# Altium schematic sheet 02_ESP12_CORE.SchDoc: ESP-12 CORE
size A4; Date: 20/11/2014; Author: HuangRui <vowstar@gmail.com>; DrawnBy: JiYaping <jyp1817@gmail.com>; Organization: WWW.NODEMCU.COM
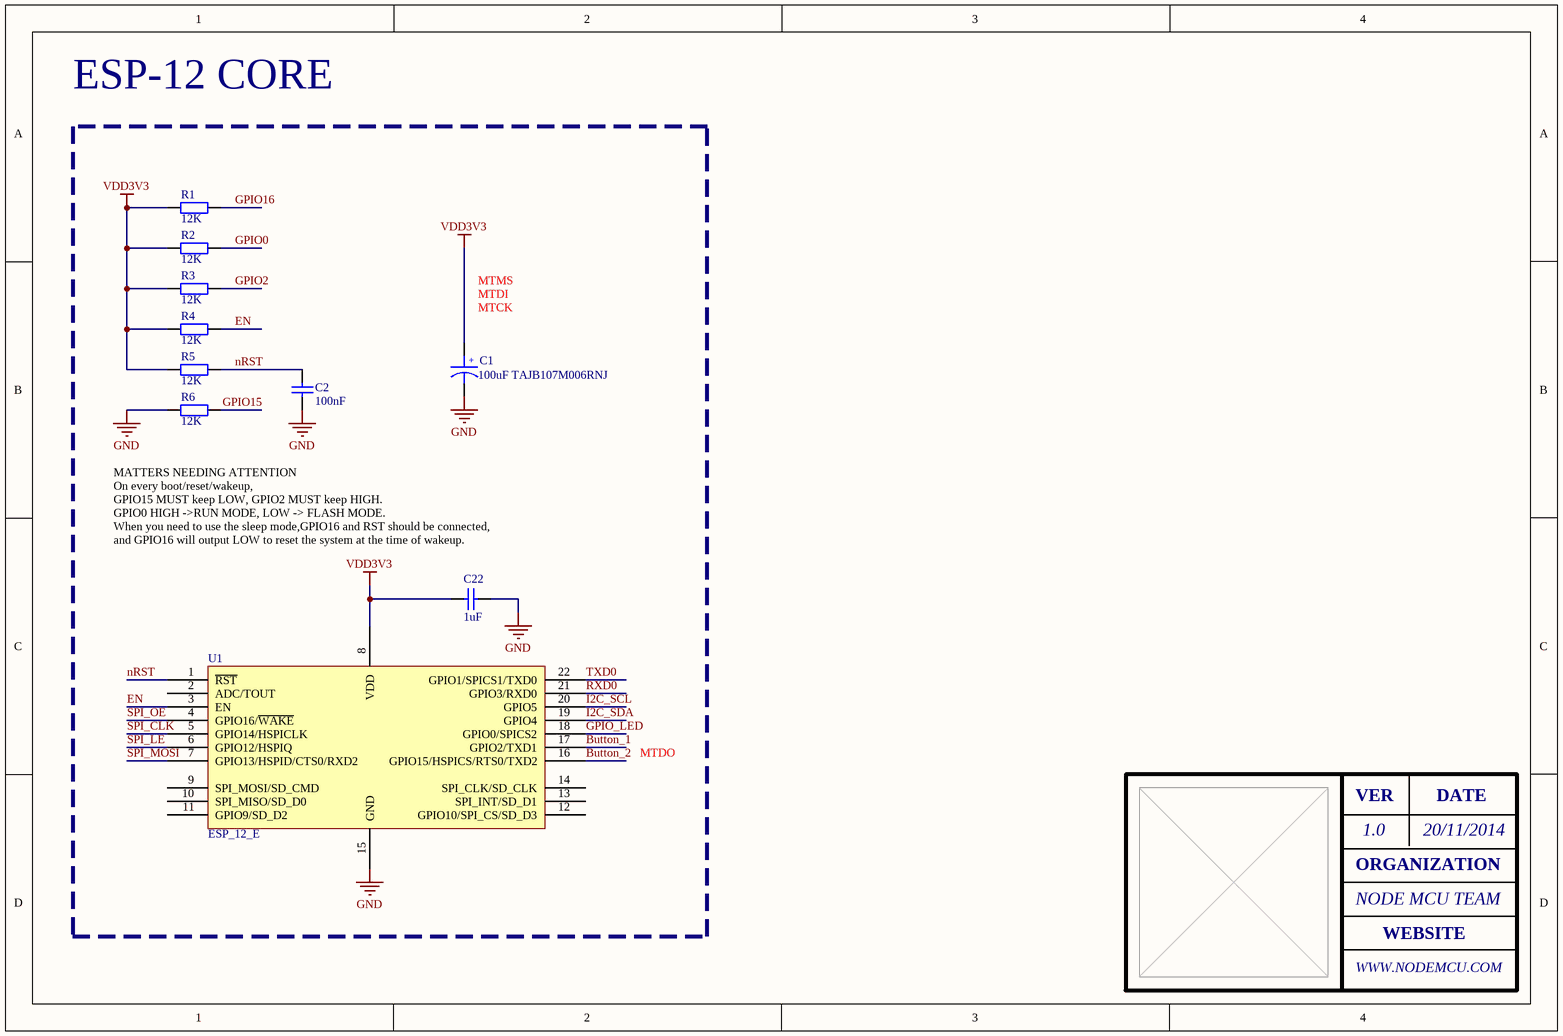
[diagram p0: 02_ESP12_CORE.SchDoc]

## Parts
C1  100uF TAJB107M006RNJ  [FP_Tantal_D]
C2  100nF  [FP_0805_CAP_085]
C22  1uF  [6-0805_M]
R1  12K  [FP_0805_RES]
R2  12K  [FP_0805_RES]
R3  12K  [FP_0805_RES]
R4  12K  [FP_0805_RES]
R5  12K  [FP_0805_RES]
R6  12K  [FP_0805_RES]
U1  ESP_12_E  [ESP_12_E _widepad]

## Nets
GND: C1.2 C2.1 C22.1 R6.1 U1.15(GND)
VDD3V3: C1.1 C22.2 R1.1 R2.1 R3.1 R4.1 R5.1 U1.8(VDD)
Button_1: U1.17(GPIO2/TXD1)
Button_2: U1.16(GPIO15/HSPICS/RTS0/TXD2)
EN: R4.2 U1.3(EN)
GPIO0: R2.2
GPIO2: R3.2
GPIO15: R6.2
GPIO16: R1.2
GPIO_LED: U1.18(GPIO0/SPICS2)
I2C_SCL: U1.20(GPIO5)
I2C_SDA: U1.19(GPIO4)
nRST: C2.2 R5.2 U1.1(~{RST})
RXD0: U1.21(GPIO3/RXD0)
SPI_CLK: U1.5(GPIO14/HSPICLK)
SPI_LE: U1.6(GPIO12/HSPIQ)
SPI_MOSI: U1.7(GPIO13/HSPID/CTS0/RXD2)
SPI_OE: U1.4(GPIO16/~{WAKE})
TXD0: U1.22(GPIO1/SPICS1/TXD0)

Not connected (* = marked no-connect by the designer): U1 2(ADC/TOUT) 9(SPI_MOSI/SD_CMD) 10(SPI_MISO/SD_D0) 11(GPIO9/SD_D2) 12(GPIO10/SPI_CS/SD_D3) 13(SPI_INT/SD_D1) 14(SPI_CLK/SD_CLK)

## Notes on the sheet
- (near C1) MTCK
- MTDI
- MTMS
- MATTERS NEEDING ATTENTION
  On every boot/reset/wakeup,
  GPIO15 MUST keep LOW, GPIO2 MUST keep HIGH.
  GPIO0 HIGH ->RUN MODE, LOW -> FLASH MODE.
  When you need to use the sleep mode,GPIO16 and RST should be connected,
  and GPIO16 will output LOW to reset the system at the time of wakeup.
- MTDO
- VER
- 1.0
- DATE
- ORGANIZATION
- NODE MCU TEAM
- WEBSITE
- (in symbol SMT_C_Tantalum_B) +

## Library data of the parts
C1 = SMT_C_Tantalum_B: Capacitor, SM Tantalum; Body 3.5 x 2.8 mm (LxW typ)
C2 = CAP 100nF: Capacitor; Tolerance: +80%/-20%; Voltage: 25V; Reference: 1759167; Name: SMD Multilayer Ceramic Capacitor, 0805; Supplier: Farnell; Value: 100nF
C22 = CAP 1uF: Capacitor; Tolerance: +80%/-20%; Voltage: 25V; Reference: 1828853; Name: SMD Multilayer Ceramic Capacitor, 0805; Supplier: Farnell; Value: 1uF
R1-R6 = RES 12K: Resistor; Tolerance: 5%; Power: 125mW; Name: YAGEO (PHYCOMP)  RC0805JR-0712KL  SMD Chip Resistor, Thick Film, 12 kohm; Reference: 9234144; Supplier: Farnell; Value: 12K
U1 = ESP_12_E: ESP-12 Wi-Fi Module by AI-Thinker; IC: ESP8266-EX; Vendor: Ai-thinker